# EAGLE design LIC_rack_BM4 (EAGLE 7.2.0)
AUTHOR: M. Petrilak; VERSION: 1.0
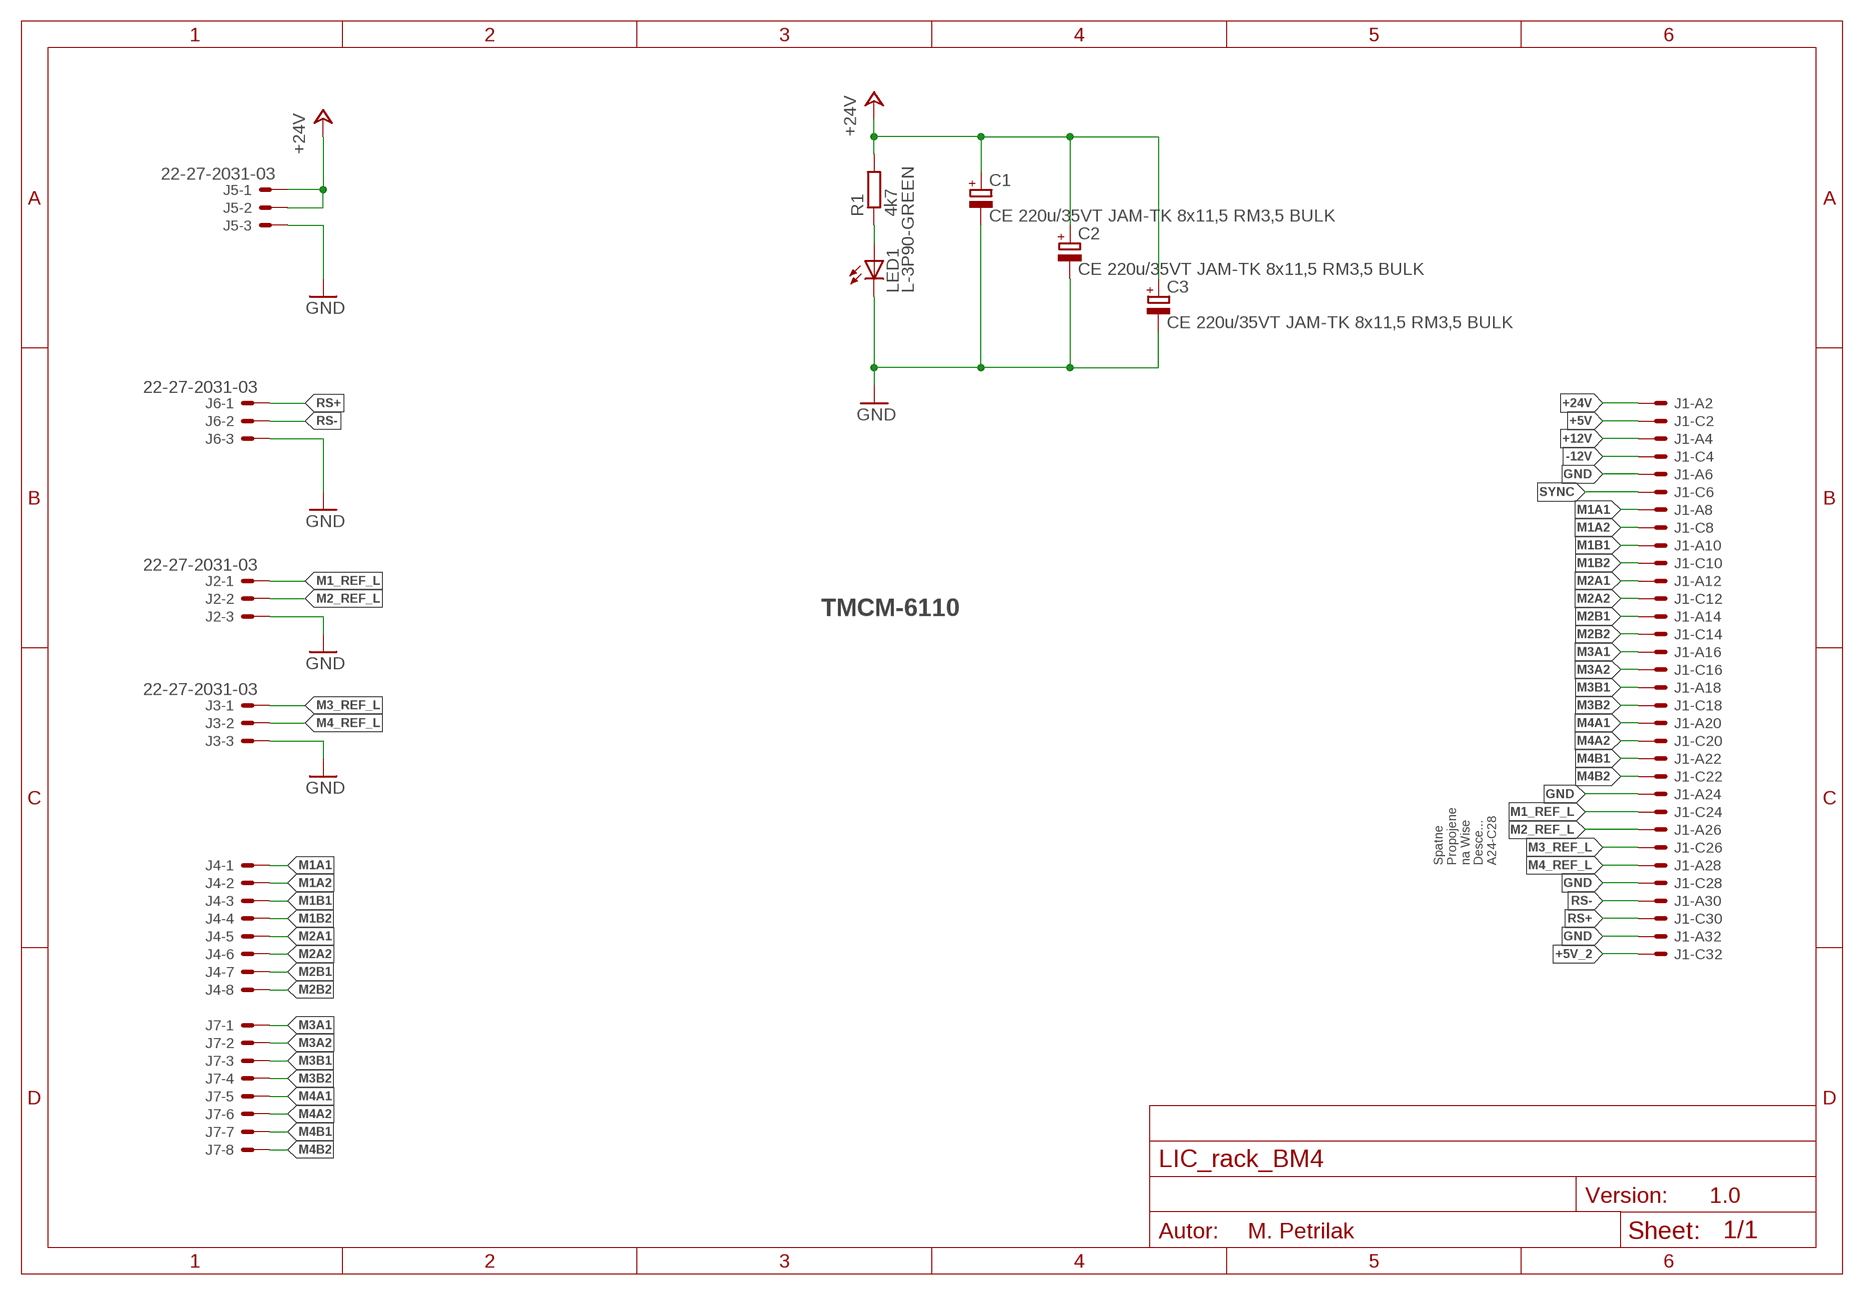
[diagram p0: schematic, sheet 1]

## Parts
C1  CE 220u/35VT JAM-TK 8x11,5 RM3,5 BULK  CPOL-EUE3.5-8L  [E3,5-8L]
C2  CE 220u/35VT JAM-TK 8x11,5 RM3,5 BULK  CPOL-EUE3.5-8L  [E3,5-8L]
C3  CE 220u/35VT JAM-TK 8x11,5 RM3,5 BULK  CPOL-EUE3.5-8L  [E3,5-8L]
J1  VG32SP  [VG32P]
J2  22-27-2031-03  [6410-03]
J3  22-27-2031-03  [6410-03]
J4  22-27-2081-08  [6410-08]
J5  22-27-2031-03  [6410-03]
J6  22-27-2031-03  [6410-03]
J7  22-27-2081-08  [6410-08]
LED1  L-3P90-GREEN  [L-3P90]
R1  4k7  R-EU_R1206  [R1206]

## Nets
+5V: J1.C2
+5V_2: J1.C32
+12V: J1.A4
+24V: C1.+ C2.+ C3.+ J1.A2 J5.1 J5.2 R1.2
-12V: J1.C4
GND: C1.- C2.- C3.- J1.A6 J1.A24 J1.A32 J1.C28 J2.3 J3.3 J5.3 J6.3 LED1.K(C)
M1_REF_L: J1.C24 J2.1
M1A1: J1.A8 J4.1
M1A2: J1.C8 J4.2
M1B1: J1.A10 J4.3
M1B2: J1.C10 J4.4
M2_REF_L: J1.A26 J2.2
M2A1: J1.A12 J4.5
M2A2: J1.C12 J4.6
M2B1: J1.A14 J4.7
M2B2: J1.C14 J4.8
M3_REF_L: J1.C26 J3.1
M3A1: J1.A16 J7.1
M3A2: J1.C16 J7.2
M3B1: J1.A18 J7.3
M3B2: J1.C18 J7.4
M4_REF_L: J1.A28 J3.2
M4A1: J1.A20 J7.5
M4A2: J1.C20 J7.6
M4B1: J1.A22 J7.7
M4B2: J1.C22 J7.8
N$3: LED1.A R1.1
RS+: J1.C30 J6.1
RS-: J1.A30 J6.2
SYNC: J1.C6

## Notes on the sheet
- TMCM-6110
- Spatne
  Propojene
  na Wise
  Desce...
  A24-C28

## Library data of the parts
C1-C3 = rcl:CPOL-EU: POLARIZED CAPACITOR, European symbol
J1 = 19inch:VG32S: PCB EUROCARD, 32-pin type C/AC, 5.08 mm
J2 J3 J5 J6 = con-molex:22-?-03: CONNECTOR wire to board 2.54 mm (.1 inch) pitch header
J4 J7 = con-molex:22-?-08: CONNECTOR wire to board 2.54 mm (.1 inch) pitch header
LED1 = led:L-3P90
R1 = rcl:R-EU_: RESISTOR, European symbol

## Board
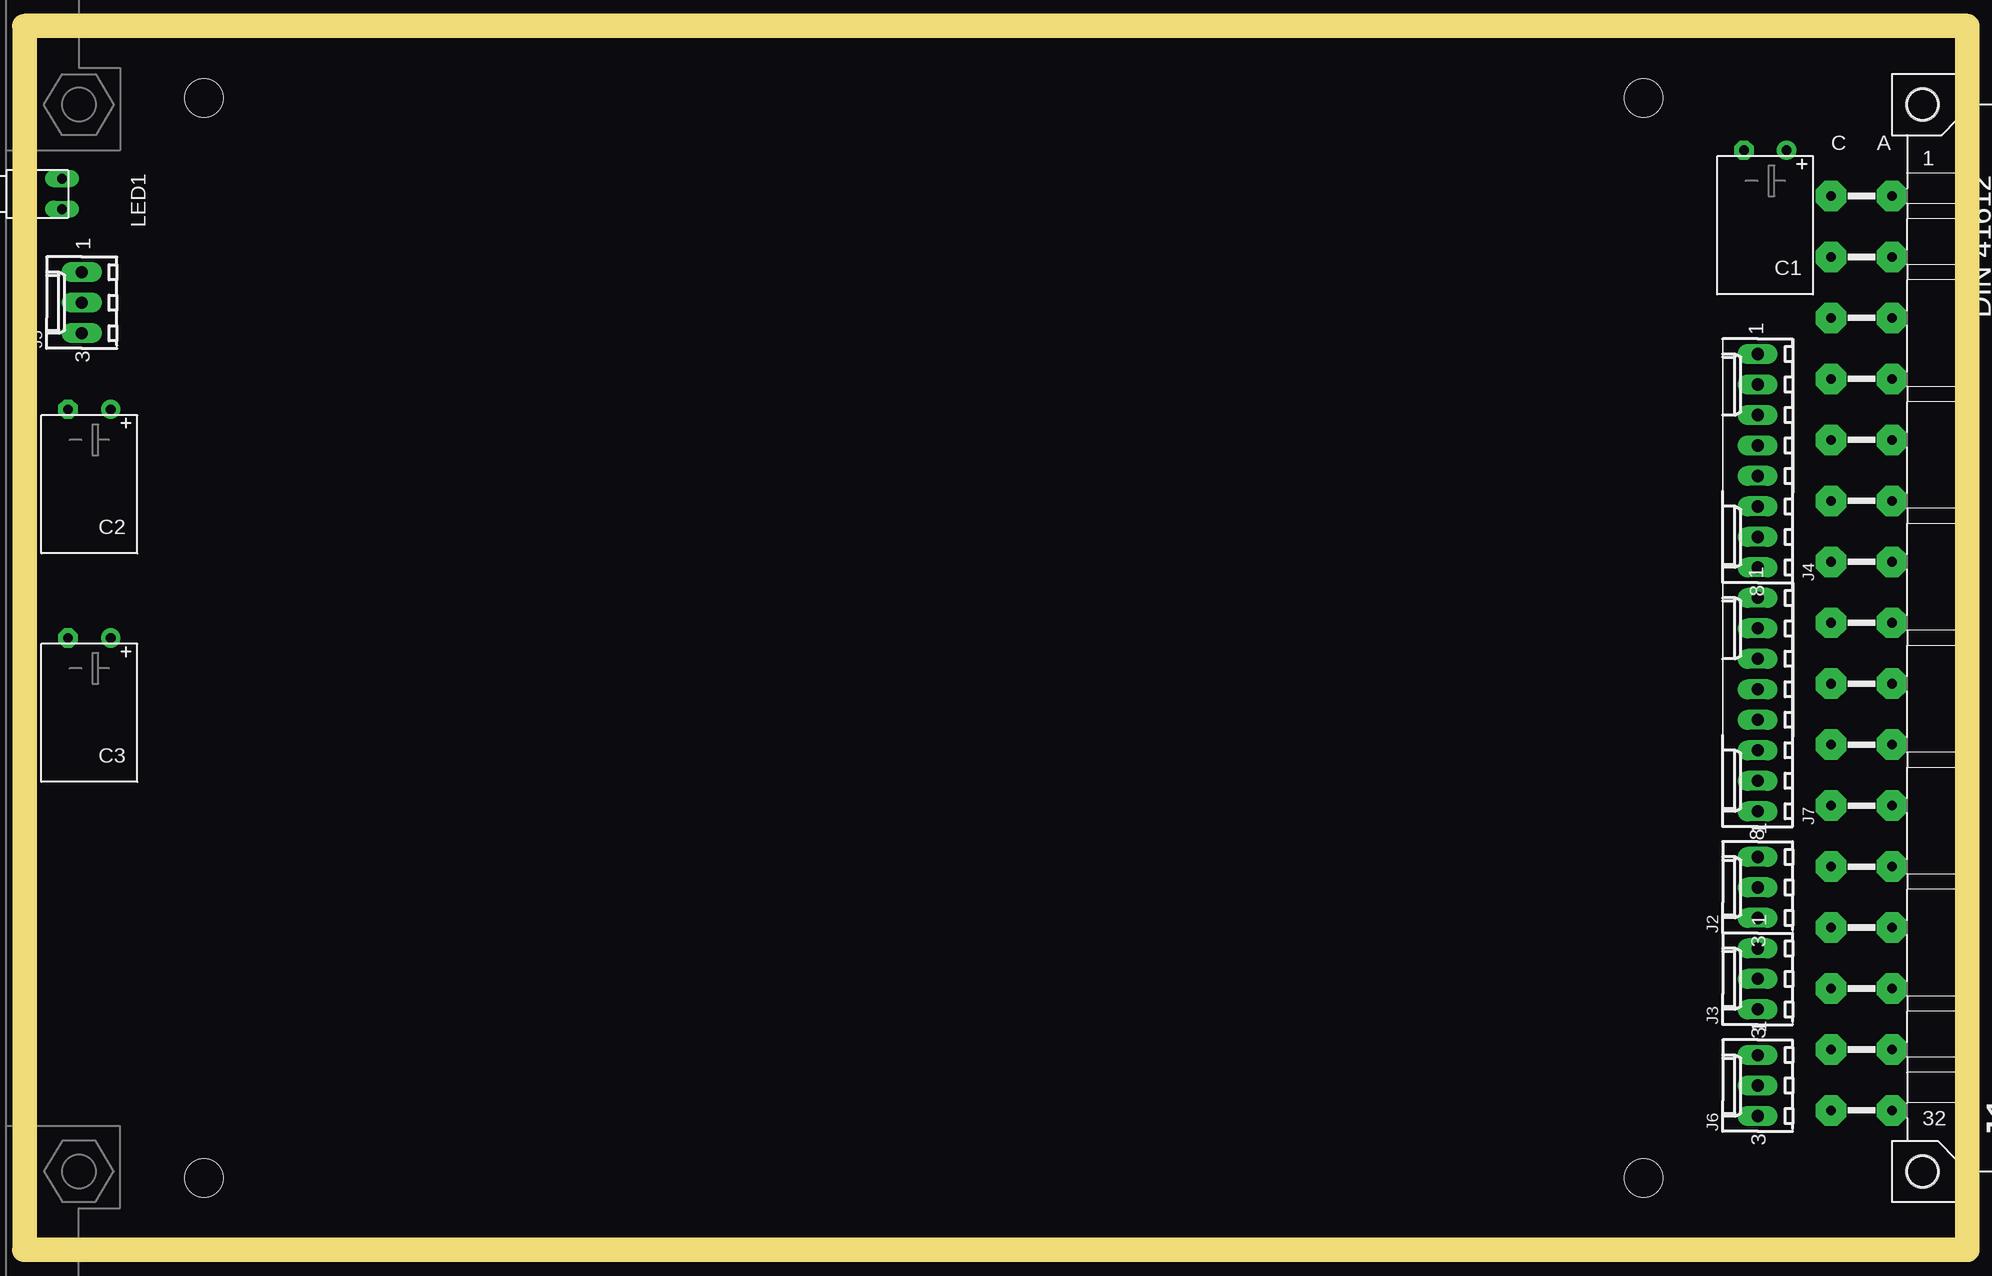
[diagram p1: board, top side]
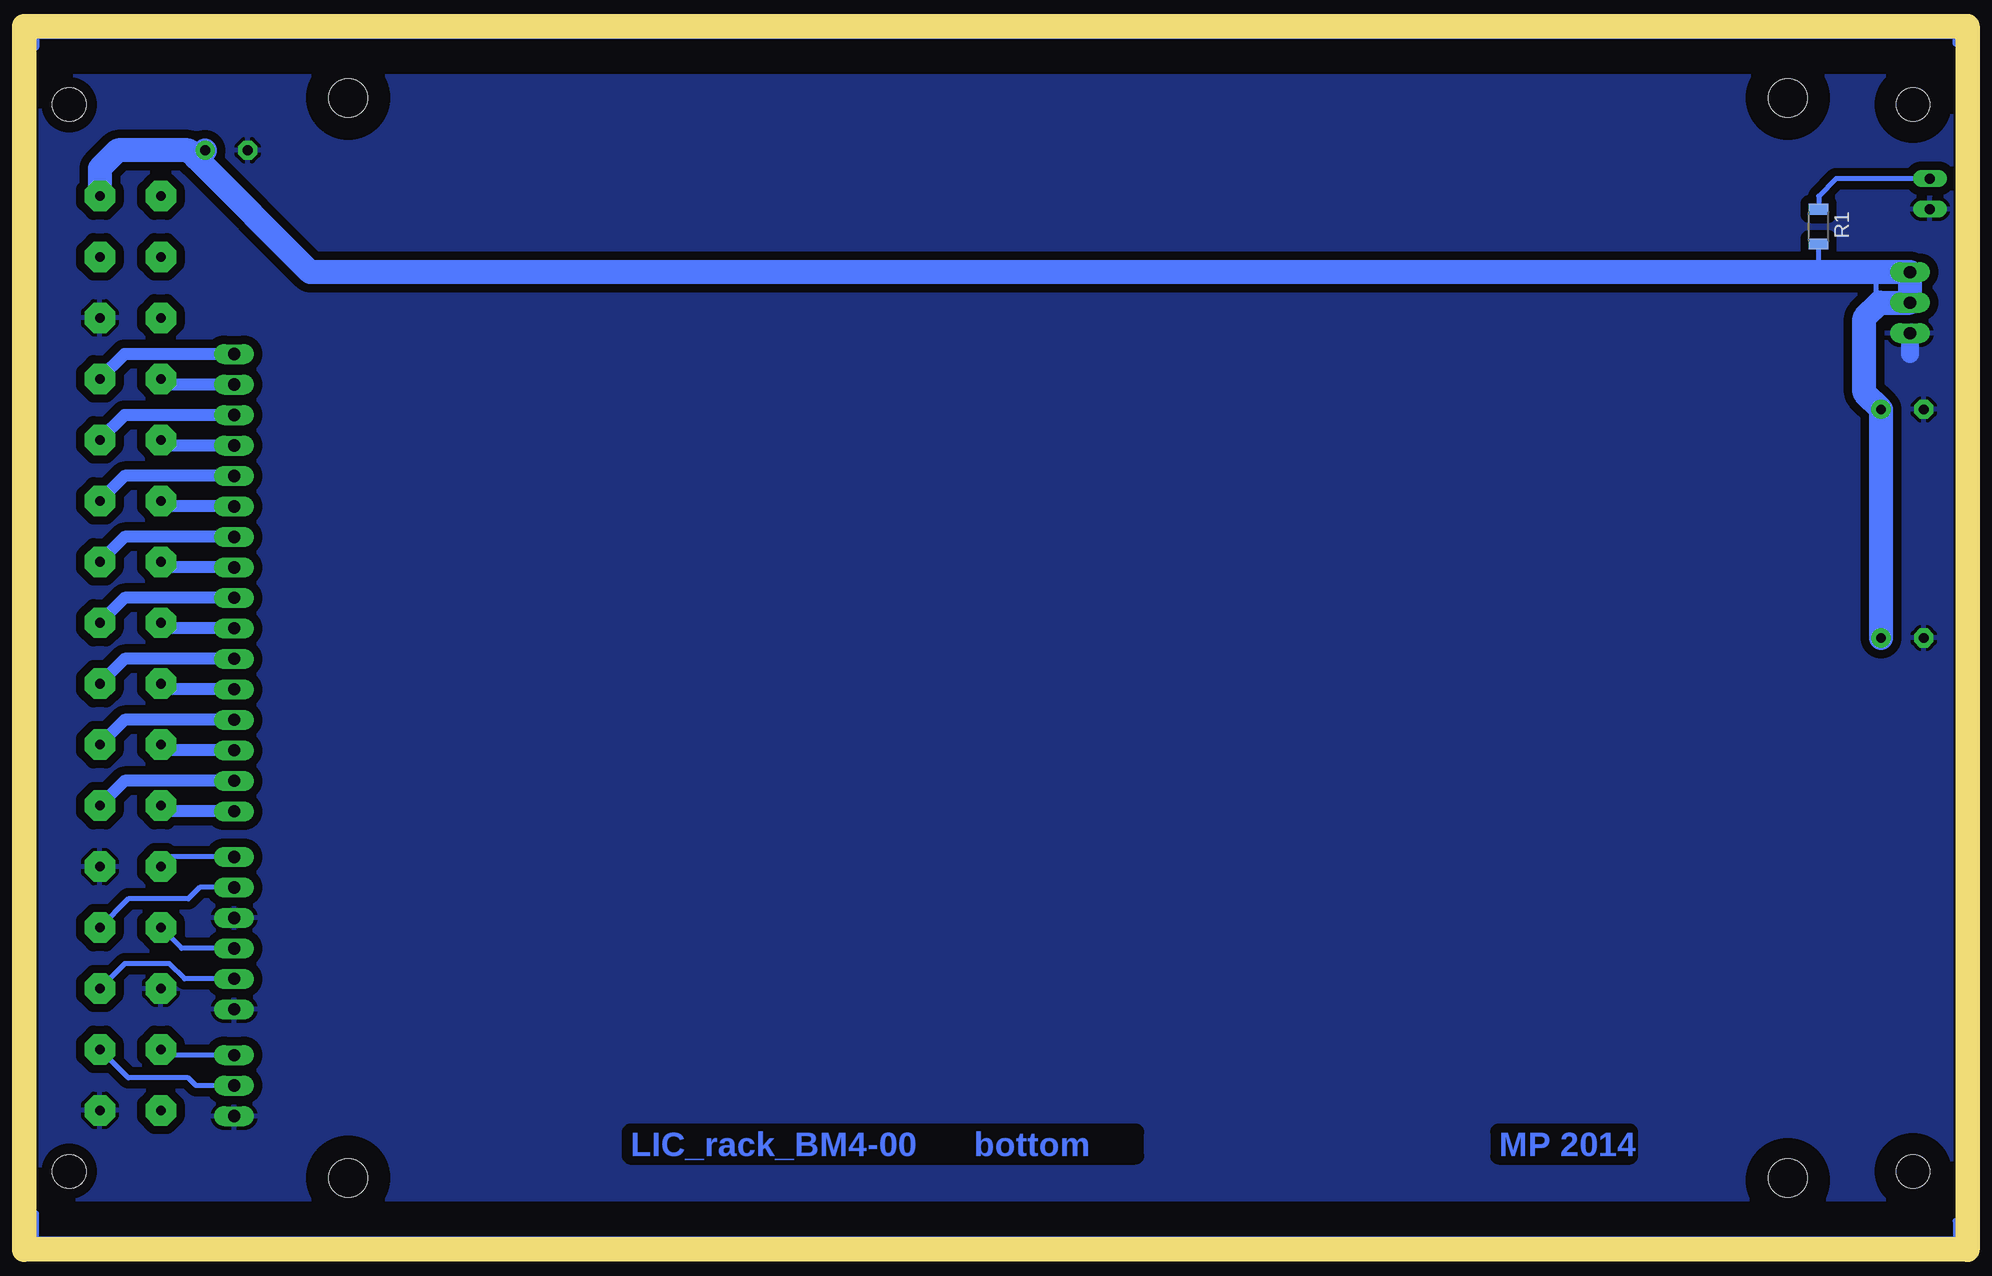
[diagram p2: board, bottom side, seen from below]

Size 160 x 100 mm. Coordinates in mm from the lower left corner, seen from the top.
Copper layers (1*16): Top 0.04mm / dielectric 1.5mm / Bottom 0.04mm
Design rules "mucha_navrh_my *": minimum track width 0.2mm, minimum drill 0.6mm, track to track 0.7mm, track to pad 0.7mm, pad to pad 0.5mm, via to via 0.3mm, smd to smd 0mil, copper to edge 0.2mm, drill to drill 0.2mm, minimum pad ring 0.3mm, minimum via ring 0.3mm, stop-mask expansion 0.1mm, vias tented up to drill 0.5mm, thermal gap 0.3mm
Holes 3.2 mm at 14,95 14,5 134,95 134,5
bRestrict: area 10.5,91.5 to 17.5,98.5; area 130.5,91.5 to 137.5,98.5; area 10.5,1.3 to 17.5,8.3; area 130.5,1.5 to 137.5,8.5

### Footprints (pad centres in the part's own frame; a part is rotated, then mirrored left to right if it is on the bottom)
E3,5-8L = drill 0.813 pad 1.6 round: + -1.778,0 | drill 0.813 pad 1.6 octagon: - 1.778,0
VG32P = drill 0.8 pad 2.54 octagon: A2 154.7,36.83; A4 154.7,31.75; A6 154.7,26.67; A8 154.7,21.59; A10 154.7,16.51; A12 154.7,11.43; A14 154.7,6.35; A16 154.7,1.27; A18 154.7,-3.81; A20 154.7,-8.89; A22 154.7,-13.97; A24 154.7,-19.05; A26 154.7,-24.13; A28 154.7,-29.21; A30 154.7,-34.29; A32 154.7,-39.37; C2 149.62,36.83; C4 149.62,31.75; C6 149.62,26.67; C8 149.62,21.59; C10 149.62,16.51; C12 149.62,11.43; C14 149.62,6.35; C16 149.62,1.27; C18 149.62,-3.81; C20 149.62,-8.89; C22 149.62,-13.97; C24 149.62,-19.05; C26 149.62,-24.13; C28 149.62,-29.21; C30 149.62,-34.29; C32 149.62,-39.37 | hole 2.794: 3.57,44.45; 3.57,-44.45; 157.24,44.45; 157.24,-44.45; 3.57,44.45; 3.57,-44.45; 157.24,44.45; 157.24,-44.45
6410-03 = drill 1.016 long: 1 2.54,0; 2 0,0; 3 -2.54,0
6410-08 = drill 1.016 long: 1 8.89,0; 2 6.35,0; 3 3.81,0; 4 1.27,0; 5 -1.27,0; 6 -3.81,0; 7 -6.35,0; 8 -8.89,0
L-3P90 = drill 0.813 long: A 4.7,1.27; K 4.7,-1.27
R1206 = smd 0.9 x 1.6: 1 -1.45,0; 2 1.45,0

### Placement (x,y rotation side)
C1  144.15,90.64 180 top
C2  4.45,69.05 180 top
C3  4.45,50 180 top
J1  0,50 0 top
J2  143.51,29.21 90 top
J3  143.51,21.59 90 top
J4  143.51,64.77 90 top
J5  3.81,77.94 90 top
J6  143.51,12.7 90 top
J7  143.51,44.45 90 top
LED1  -2.54,87 0 top
R1  11.43,84.29 270 bottom

### Tracks (layer width: path | path; a pad name or v marks a point on that pad's centre or on a via)
+24V
  Bottom 0.406: 11.43,80.48 R1.2
  Bottom 2: J1.A2 154.7,89.14 153.2,90.64 147.32,90.64 146.69,90 | J5.2 J5.1 | J5.2 J5.1 | J5.1 11.43,80.48 137.16,80.48 146.69,90 | C1.+ 146.56,90 146.69,90 | J5.2 6.35,77.94 7.62,76.67 7.62,70.45 C2.+ C3.+
GND
  Bottom 1.5: 3.81,73.66 J5.3
  pour Bottom: 0,0 160,0 160,100 0,100
M1_REF_L
  Bottom 0.406: J2.1 148.82,31.75 J1.C24
M1A1
  Bottom 1: J4.1 152.63,73.66 J1.A8
M1A2
  Bottom 1: J4.2 149.15,71.12 J1.C8
M1B1
  Bottom 1: J4.3 152.63,68.58 J1.A10
M1B2
  Bottom 1: J4.4 149.15,66.04 J1.C10
M2_REF_L
  Bottom 0.406: J2.2 146.37,29.21 147.32,28.26 152.31,28.26 J1.A26
M2A1
  Bottom 1: J4.5 152.63,63.5 J1.A12
M2A2
  Bottom 1: J4.6 149.15,60.96 J1.C12
M2B1
  Bottom 1: J4.7 152.63,58.42 J1.A14
M2B2
  Bottom 1: J4.8 149.15,55.88 J1.C14
M3_REF_L
  Bottom 0.406: J3.1 147.88,24.13 J1.C26
M3A1
  Bottom 1: J7.1 152.63,53.34 J1.A16
M3A2
  Bottom 1: J7.2 149.15,50.8 J1.C16
M3B1
  Bottom 1: J7.3 152.63,48.26 J1.A18
M3B2
  Bottom 1: J7.4 149.15,45.72 J1.C18
M4_REF_L
  Bottom 0.406: J3.2 147.64,21.59 148.91,22.86 152.63,22.86 J1.A28
M4A1
  Bottom 1: J7.5 152.63,43.18 J1.A20
M4A2
  Bottom 1: J7.6 149.15,40.64 J1.C20
M4B1
  Bottom 1: J7.7 152.63,38.1 J1.A22
M4B2
  Bottom 1: J7.8 149.15,35.56 J1.C22
N$1
  Bottom 0.406: 6.67,80.16 6.67,78.26
N$2
  Bottom 0.5: 0,1.42 0,-0.16 160.02,-0.16 160.02,2.06
N$3
  Bottom 0.406: LED1.A 9.99,88.27 11.43,86.83 R1.1
N$4
  Bottom 0.5: 160.02,99.21 160.02,100.16 0,100.16 0,99.53
RS+
  Bottom 0.406: J1.C30 149.15,15.24 J6.1
RS-
  Bottom 0.406: J6.2 146.69,12.7 147.32,13.34 152.32,13.34 J1.A30

### Text on the board
Bottom: MP 2014 | LIC_rack_BM4-00 bottom